# Altium schematic sheet PCIe-SATA.SchDoc
size A3; DocumentNumber: 5; SheetNumber: 5; SheetTotal: 9; PageSetup: Record=PageOptions|CenterHorizontal=True|CenterVertical=True|PrintScale=0.97|XCorrection=1.00|YCorrection=1.00|PrintKind=1|BorderSize=5000000|LeftOffset=0|BottomOffset=0|Orientation=2|PaperLength=2970|PaperWidth=2100|Scale=100|PaperSource=7|PrintQuality=600|MediaType=1|DitherType=10|PaperKind=A4|PrintScaleMode=1
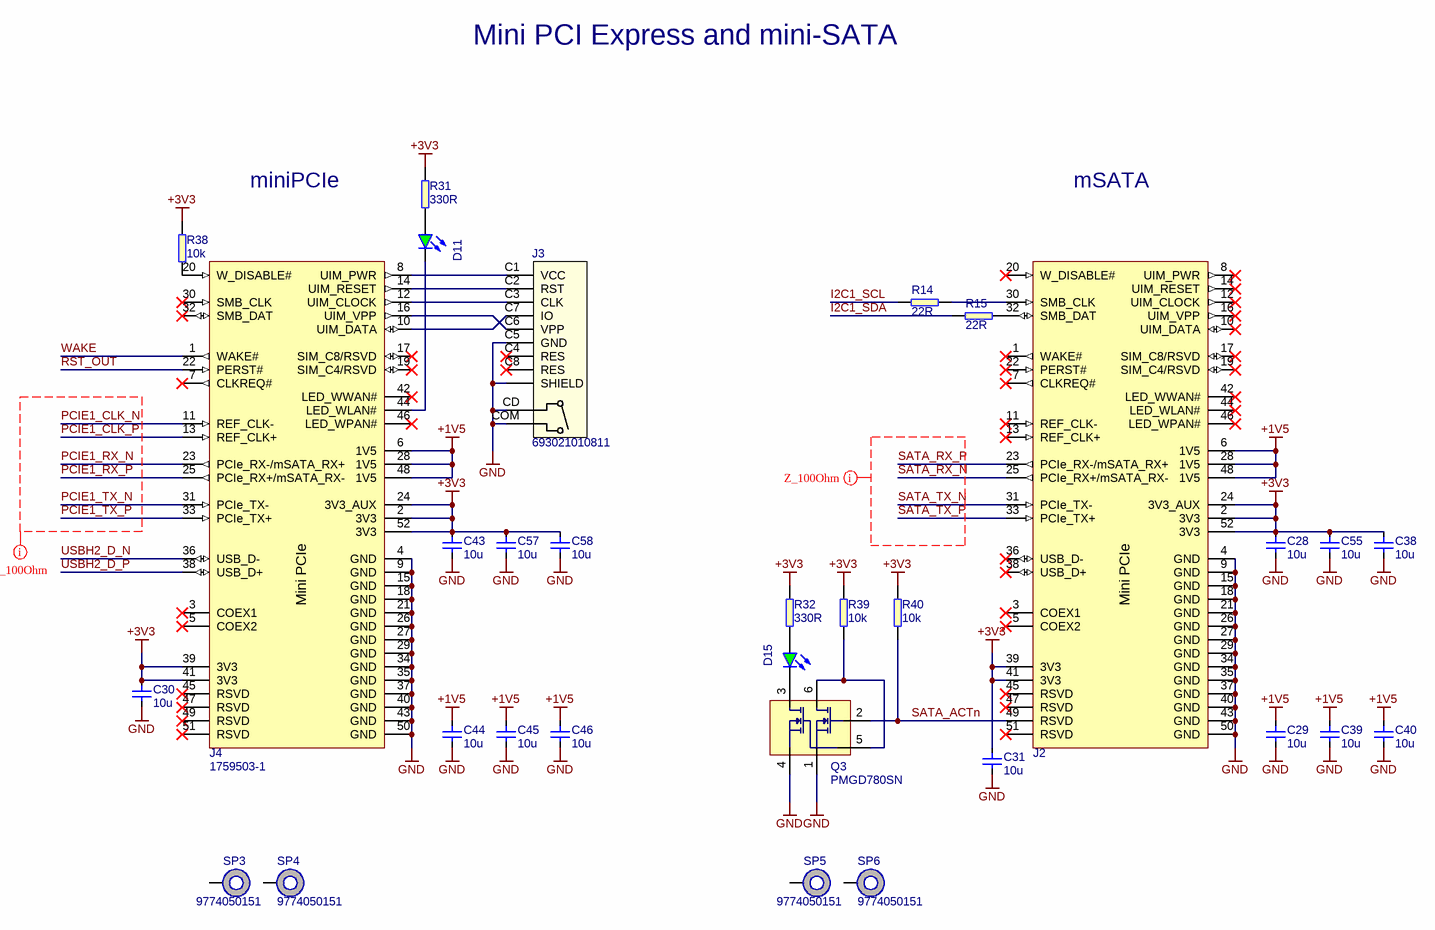
[diagram p0: PCIe-SATA.SchDoc]

## Parts
C28  10u  [0603]
C29  10u  [0603]
C30  10u  [0603]
C31  10u  [0603]
C38  10u  [0603]
C39  10u  [0603]
C40  10u  [0603]
C43  10u  [0603]
C44  10u  [0603]
C45  10u  [0603]
C46  10u  [0603]
C55  10u  [0603]
C57  10u  [0603]
C58  10u  [0603]
D11  KPT-1608SGC  [LED0603]  (value not drawn)
D15  KPT-1608SGC  [LED0603]  (value not drawn)
J2  1759503-1  [1759503-1]  (value not drawn)
J3  693021010811  [693021010811]
J4  1759503-1  [1759503-1]
Q3  PMGD780SN  [SOT-363]
R14  22R  [0402]
R15  22R  [0402]
R31  330R  [0402]
R32  330R  [0402]
R38  10k  [0402]
R39  10k  [0402]
R40  10k  [0402]
SP3  9774050151  [M2.5-5mm]
SP4  9774050151  [M2.5-5mm]
SP5  9774050151  [M2.5-5mm]
SP6  9774050151  [M2.5-5mm]

## Nets
+1V5: C29.1 C39.1 C40.1 C44.1 C45.1 C46.1 J2.6(1V5) J2.28(1V5) J2.48(1V5) J4.6(1V5) J4.28(1V5) J4.48(1V5)
+3V3: C28.1 C30.1 C31.1 C38.1 C43.1 C55.1 C57.1 C58.1 J2.2(3V3) J2.24(3V3_AUX) J2.39(3V3) J2.41(3V3) J2.52(3V3) J4.2(3V3) J4.24(3V3_AUX) J4.39(3V3) J4.41(3V3) J4.52(3V3) R31.2 R32.2 R38.2 R39.2 R40.2
GND: C28.2 C29.2 C30.2 C31.2 C38.2 C39.2 C40.2 C43.2 C44.2 C45.2 C46.2 C55.2 C57.2 C58.2 J2.4(GND) J2.9(GND) J2.15(GND) J2.18(GND) J2.21(GND) J2.26(GND) J2.27(GND) J2.29(GND) J2.34(GND) J2.35(GND) J2.37(GND) J2.40(GND) J2.43(GND) J2.50(GND) J3.C5(GND) J3.CD J3.COM J3.SHIELD J4.4(GND) J4.9(GND) J4.15(GND) J4.18(GND) J4.21(GND) J4.26(GND) J4.27(GND) J4.29(GND) J4.34(GND) J4.35(GND) J4.37(GND) J4.40(GND) J4.43(GND) J4.50(GND) Q3.1(S1) Q3.4(S2)
I2C1_SCL: R14.1
I2C1_SDA: R15.1
PCIE1_CLK_N: J4.11(REF_CLK-)
PCIE1_CLK_P: J4.13(REF_CLK+)
PCIE1_RX_N: J4.23(PCIe_RX-/mSATA_RX+)
PCIE1_RX_P: J4.25(PCIe_RX+/mSATA_RX-)
PCIE1_TX_N: J4.31(PCIe_TX-)
PCIE1_TX_P: J4.33(PCIe_TX+)
RST_OUT: J4.22(PERST#)
SATA_ACTn: J2.49(RSVD) Q3.2(G1) R40.1
SATA_RX_N: J2.25(PCIe_RX+/mSATA_RX-)
SATA_RX_P: J2.23(PCIe_RX-/mSATA_RX+)
SATA_TX_N: J2.31(PCIe_TX-)
SATA_TX_P: J2.33(PCIe_TX+)
USBH2_D_N: J4.36(USB_D-)
USBH2_D_P: J4.38(USB_D+)
WAKE: J4.1(WAKE#)
NetD11_A: D11.A R31.1
NetD11_K: D11.K J4.44(LED_WLAN#)
NetD15_A: D15.A R32.1
NetD15_K: D15.K Q3.3(D2)
NetJ2_30: J2.30(SMB_CLK) R14.2
NetJ2_32: J2.32(SMB_DAT) R15.2
NetJ3_C1: J3.C1(VCC) J4.8(UIM_PWR)
NetJ3_C2: J3.C2(RST) J4.14(UIM_RESET)
NetJ3_C3: J3.C3(CLK) J4.12(UIM_CLOCK)
NetJ3_C6: J3.C6(VPP) J4.16(UIM_VPP)
NetJ3_C7: J3.C7(IO) J4.10(UIM_DATA)
NetJ4_20: J4.20(W_DISABLE#) R38.1
NetQ3_5: Q3.5(G2) Q3.6(D1) R39.1

Not connected (* = marked no-connect by the designer): J2 1(WAKE#)* 3(COEX1)* 5(COEX2)* 7(CLKREQ#)* 8(UIM_PWR)* 10(UIM_DATA)* 11(REF_CLK-)* 12(UIM_CLOCK)* 13(REF_CLK+)* 14(UIM_RESET)* 16(UIM_VPP)* 17(SIM_C8/RSVD)* 19(SIM_C4/RSVD)* 20(W_DISABLE#)* 22(PERST#)* 36(USB_D-)* 38(USB_D+)* 42(LED_WWAN#)* 44(LED_WLAN#)* 45(RSVD)* 46(LED_WPAN#)* 47(RSVD)* 51(RSVD)*; J3 C4(RES)* C8(RES)*; J4 3(COEX1)* 5(COEX2)* 7(CLKREQ#)* 17(SIM_C8/RSVD)* 19(SIM_C4/RSVD)* 30(SMB_CLK)* 32(SMB_DAT)* 42(LED_WWAN#)* 45(RSVD)* 46(LED_WPAN#)* 47(RSVD)* 49(RSVD)* 51(RSVD)*; SP3 1; SP4 1; SP5 1; SP6 1

## Layout directives
net class Z_100Ohm: PCIE1_CLK_N, PCIE1_CLK_P, PCIE1_RX_N, PCIE1_RX_P, PCIE1_TX_N, PCIE1_TX_P, SATA_RX_N, SATA_RX_P, SATA_TX_N, SATA_TX_P

## Notes on the sheet
- Mini PCI Express and mini-SATA
- miniPCIe
- mSATA
- Title:
- Size:
- Date:
- A3
- Revision:
- Page:
- of
- Antmicro Ltd.
- File:
- www.antmicro.com
- (in symbol MiniPCIExpress) Mini PCIe

## Library data of the parts
C28-C31 C38-C40 C43-C46 C55 C57 C58 = C_10u_0603: MLCC SMT Capacitor 10uF 0603; Manufacturer: Walsin; Part Symbol: 0603X106M6R3CT; Value: 10u; Part Number: C_10u_0603; MPN: 0603X106M6R3CT
D11 D15 = LED_G: LED Green 0603 case; Manufacturer: KINGBRIGHT; Part Number: LED_G; Value: KPT-1608SGC; Part Symbol: KPT-1608SGC; MPN: KPT-1608SGC
J2 J4 = MiniPCIExpress: Mini PCI Express 8mm; Part Number: TE-1759503-1; Manufacturer: TE CONNECTIVITY; Value: 1759503-1; Part Symbol: 1759503-1; MPN: 1759503-1
J3 = SIM-8P-CD: Micro SIM Card Connector WR-CRD, Push & Push - with Card Detection; Manufacturer: WURTH ELEKTRONIK; Part Number: WE-693-021-010-811; Value: 693021010811; Part Symbol: 693021010811; MPN: 693021010811
Q3 = PMGD780SN: 60 V, dual N-channel Trench MOSFET; Manufacturer: NXP; Part Symbol: PMGD780SN,115; Part Number: PMGD780SN; Value: PMGD780SN; MPN: PMGD780SN,115
R14 R15 = R_22R_0402: RES, 22R, 0402; Manufacturer: VISHAY; Part Symbol: CRCW040222R0FKED; Value: 22R; Part Number: R_22R_0402; MPN: CRCW040222R0FKED
R31 R32 = R_330R_0402: RES, 330R, 0402; Manufacturer: MULTICOMP; Part Symbol: MCMR04X3300FTL; Value: 330R; Part Number: R_330R_0402; MPN: MCMR04X3300FTL
R38-R40 = R_10k_0402: RES, 10k, 0402; Manufacturer: MULTICOMP; Part Symbol: MCMR04X1002FTL; Value: 10k; Part Number: R_10k_0402; MPN: MCMR04X1002FTL
SP3-SP6 = M2.5x5: Manufacturer: WURTH ELEKTRONIK; Part Number: 9774050151; Value: 9774050151; Part Symbol: 9774050151; MPN: 9774050151